# EAGLE design Timer-Ruler_CR2032_on_bottom (EAGLE 7.5.0)
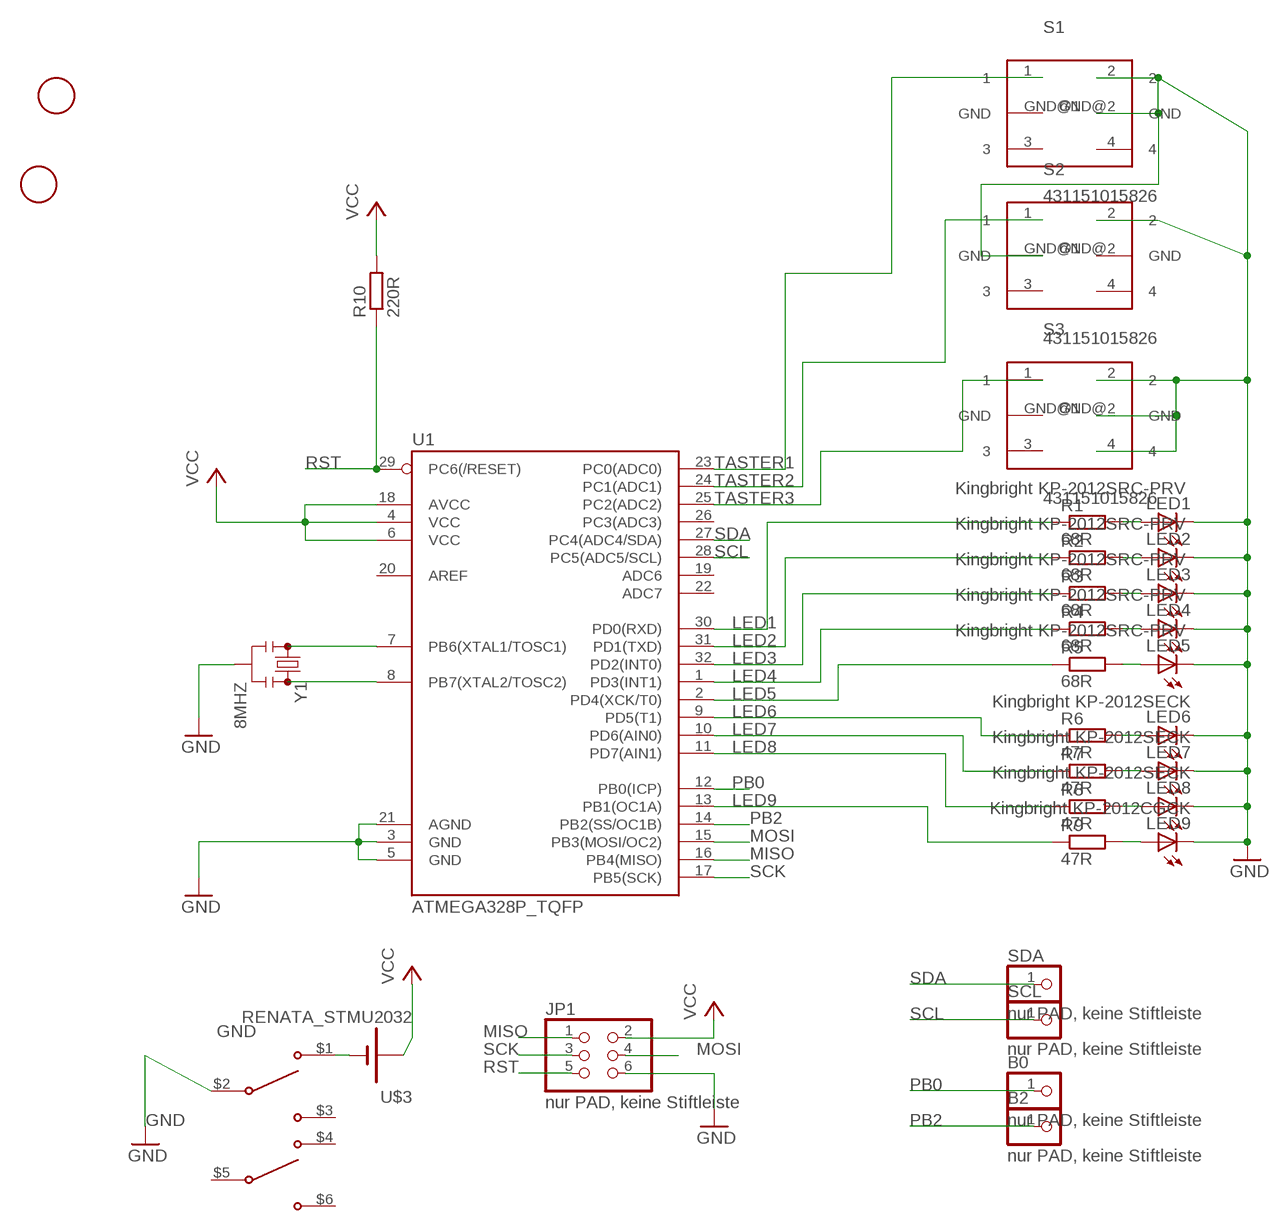
[diagram p0: schematic, sheet 1]

## Parts
B0  nur PAD, keine Stiftleiste  PINHD-1X1  [1X01]
B2  nur PAD, keine Stiftleiste  PINHD-1X1  [1X01]
JP1  nur PAD, keine Stiftleiste  PINHD-2X3  [2X03]
LED1  Kingbright KP-2012SRC-PRV  LEDCHIP-LED0805  [CHIP-LED0805]
LED2  Kingbright KP-2012SRC-PRV  LEDCHIP-LED0805  [CHIP-LED0805]
LED3  Kingbright KP-2012SRC-PRV  LEDCHIP-LED0805  [CHIP-LED0805]
LED4  Kingbright KP-2012SRC-PRV  LEDCHIP-LED0805  [CHIP-LED0805]
LED5  Kingbright KP-2012SRC-PRV  LEDCHIP-LED0805  [CHIP-LED0805]
LED6  Kingbright KP-2012SECK  LEDCHIP-LED0805  [CHIP-LED0805]
LED7  Kingbright KP-2012SECK  LEDCHIP-LED0805  [CHIP-LED0805]
LED8  Kingbright KP-2012SECK  LEDCHIP-LED0805  [CHIP-LED0805]
LED9  Kingbright KP-2012CGCK  LEDCHIP-LED0805  [CHIP-LED0805]
R1  68R  R-EU_R0402  [R0402]
R2  68R  R-EU_R0402  [R0402]
R3  68R  R-EU_R0402  [R0402]
R4  68R  R-EU_R0402  [R0402]
R5  68R  R-EU_R0402  [R0402]
R6  47R  R-EU_R0402  [R0402]
R7  47R  R-EU_R0402  [R0402]
R8  47R  R-EU_R0402  [R0402]
R9  47R  R-EU_R0402  [R0402]
R10  220R  R-EU_R0402  [R0402]
S1  431151015826  [431181015816]
S2  431151015826  [431181015816]
S3  431151015826  [431181015816]
SCL  nur PAD, keine Stiftleiste  PINHD-1X1  [1X01]
SDA  nur PAD, keine Stiftleiste  PINHD-1X1  [1X01]
U1  ATMEGA328P_TQFP  [TQFP32-08]
U$1  FIDUCIAL  [FIDUCIAL_1MM]
U$2  FIDUCIAL  [FIDUCIAL_1MM]
U$3  RENATA_STMU2032  [SMTU2032]
U$4  C+K_AYZ0202AGRLC  [C+K_AYZ0202AGRLC]
Y1  8MHZ  RESONATOR8MHZ  [RESONATOR-SMD]

## Nets
GND: JP1.6 LED1.C LED2.C LED3.C LED4.C LED5.C LED6.C LED7.C LED8.C LED9.C S1.2 S1.GND@2(GND) S2.2 S2.GND@1(GND) S3.2 S3.4 S3.GND@2(GND) U1.3(GND) U1.5(GND) U1.21(AGND) U$4.$2 Y1.2
LED1: R1.1 U1.30(PD0(RXD))
LED2: R2.1 U1.31(PD1(TXD))
LED3: R3.1 U1.32(PD2(INT0))
LED4: R4.1 U1.1(PD3(INT1))
LED5: R5.1 U1.2(PD4(XCK/T0))
LED6: R6.1 U1.9(PD5(T1))
LED7: R7.1 U1.10(PD6(AIN0))
LED8: R8.1 U1.11(PD7(AIN1))
LED9: R9.1 U1.13(PB1(OC1A))
MISO: JP1.1 U1.16(PB4(MISO))
MOSI: JP1.4 U1.15(PB3(MOSI/OC2))
N$1: LED1.A R1.2
N$2: LED2.A R2.2
N$3: LED3.A R3.2
N$4: LED4.A R4.2
N$5: LED5.A R5.2
N$6: LED6.A R6.2
N$7: LED7.A R7.2
N$8: LED8.A R8.2
N$9: LED9.A R9.2
N$10: U1.7(PB6(XTAL1/TOSC1)) Y1.1
N$12: U1.8(PB7(XTAL2/TOSC2)) Y1.3
N$14: U$3.- U$4.$1
PB0: B0.1 U1.12(PB0(ICP))
PB2: B2.1 U1.14(PB2(SS/OC1B))
RST: JP1.5 R10.1 U1.29(PC6(/RESET))
SCK: JP1.3 U1.17(PB5(SCK))
SCL: SCL.1 U1.28(PC5(ADC5/SCL))
SDA: SDA.1 U1.27(PC4(ADC4/SDA))
TASTER1: S1.1 U1.23(PC0(ADC0))
TASTER2: S2.1 U1.24(PC1(ADC1))
TASTER3: S3.1 U1.25(PC2(ADC2))
VCC: JP1.2 R10.2 U1.4(VCC) U1.6(VCC) U1.18(AVCC) U$3.+
Unconnected: S1.3 S1.4 S1.GND@1(GND) S2.3 S2.4 S2.GND@2(GND) S3.3 S3.GND@1(GND) U1.19(ADC6) U1.20(AREF) U1.22(ADC7) U1.26(PC3(ADC3)) U$4.$3 U$4.$4 U$4.$5 U$4.$6

## Library data of the parts
B0 B2 SCL SDA = pinhead:PINHD-1X1: PIN HEADER
JP1 = pinhead:PINHD-2X3: PIN HEADER
LED1-LED9 = led:LED: LED OSRAM: - CHIPLED LG R971, LG N971, LY N971, LG Q971, LY Q971, LO R971, LY R971 LH N974, LH R974 LS Q976, LO Q976, LY Q976 LO Q996 - Hyper CHIPLED LW Q18S LB Q993, LB Q99A, LB R99A - SideLED LS A670, LO A670, LY A670, LG A670, LP A670 LB A673, LV A673, LT A673, LW A673 LH A674 LY A675 LS A676, LA A676, LO A676, LY A676, LW A676 LS A679, LY A679, LG A679 - Hyper Micro SIDELED® LS Y876, LA Y876, LO Y876, LY Y876 LT Y87S - SmartLED LW L88C, LW L88S LB L89C, LB L89S, LG L890 LS L89K, LO L89K, LY L89K LS L896, LA L896, LO L896, LY L896 - TOPLED LS T670, LO T670, LY T670, LG T670, LP T670 LSG T670, LSP T670, LSY T670, LOP T670, LYG T670 LG T671, LOG T671, LSG T671 LB T673, LV T673, LT T673, LW T673 LH T674 LS T676, LA T676, LO T676, LY T676, LB T676, LH T676, LSB T676, LW T676 LB T67C, LV T67C, LT T67C, LS T67K, LO T67K, LY T67K, LW E67C LS E67B, LA E67B, LO E67B, LY E67B, LB E67C, LV E67C, LT E67C LW T67C LS T679, LY T679, LG T679 LS T770, LO T770, LY T770, LG T770, LP T770 LB T773, LV T773, LT T773, LW T773 LH T774 LS E675, LA E675, LY E675, LS T675 LS T776, LA T776, LO T776, LY T776, LB T776 LHGB T686 LT T68C, LB T68C - Hyper Mini TOPLED® LB M676 - Mini TOPLED Santana® LG M470 LS M47K, LO M47K, LY M47K Source: http://www.osram.convergy.de LUXEON: - LUMILED® LXK2-PW12-R00, LXK2-PW12-S00, LXK2-PW14-U00, LXK2-PW14-V00 LXK2-PM12-R00, LXK2-PM12-S00, LXK2-PM14-U00 LXK2-PE12-Q00, LXK2-PE12-R00, LXK2-PE12-S00, LXK2-PE14-T00, LXK2-PE14-U00 LXK2-PB12-K00, LXK2-PB12-L00, LXK2-PB12-M00, LXK2-PB14-N00, LXK2-PB14-P00, LXK2-PB14-Q00 LXK2-PR12-L00, LXK2-PR12-M00, LXK2-PR14-Q00, LXK2-PR14-R00 LXK2-PD12-Q00, LXK2-PD12-R00, LXK2-PD12-S00 LXK2-PH12-R00, LXK2-PH12-S00 LXK2-PL12-P00, LXK2-PL12-Q00, LXK2-PL12-R00 Source: www.luxeon.com KINGBRIGHT: KA-3528ASYC Source: www.kingbright.com
R1-R10 = resistor:R-EU_: RESISTOR, European symbol
S1-S3 = Wurth_Elektronik_Electromechanic_Switchs_rev15b:431151015826: WS-TSS-5x5 mm SMD Tact Switch with ground terminal, 4 pins
U1 = SparkFun-DigitalIC:ATMEGA328P_TQFP; PROD_ID: IC-09069
U$1 U$2 = adafruit:FIDUCIAL: For use by pick and place machines to calibrate the vision/machine, 1mm By microbuilder.eu
U$3 = Ava:RENATA_STMU2032
U$4 = Ava:C+K_AYZ0202AGRLC
Y1 = SparkFun-FreqCtrl:RESONATOR: Resonator Small SMD resonator. Used, eg, on the Arduino Pro/ Pro Mini boards. 8MHz- XTAL-08895 16MHz- XTAL-08900; PROD_ID: XTAL-08895

## Board
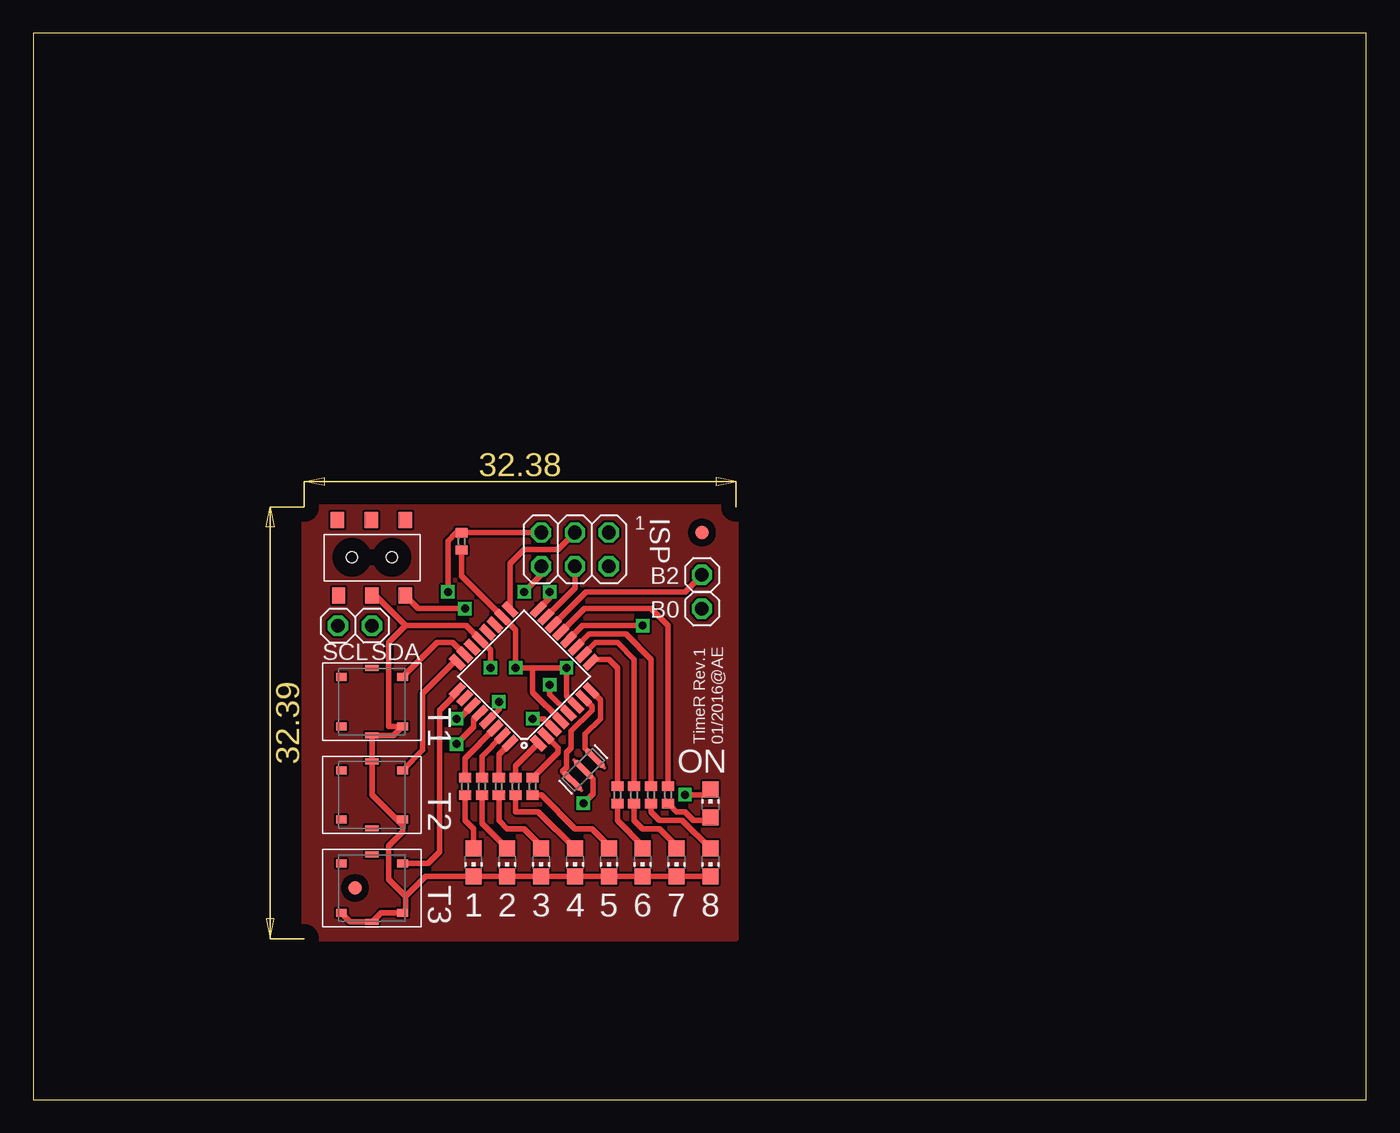
[diagram p1: board, top side]
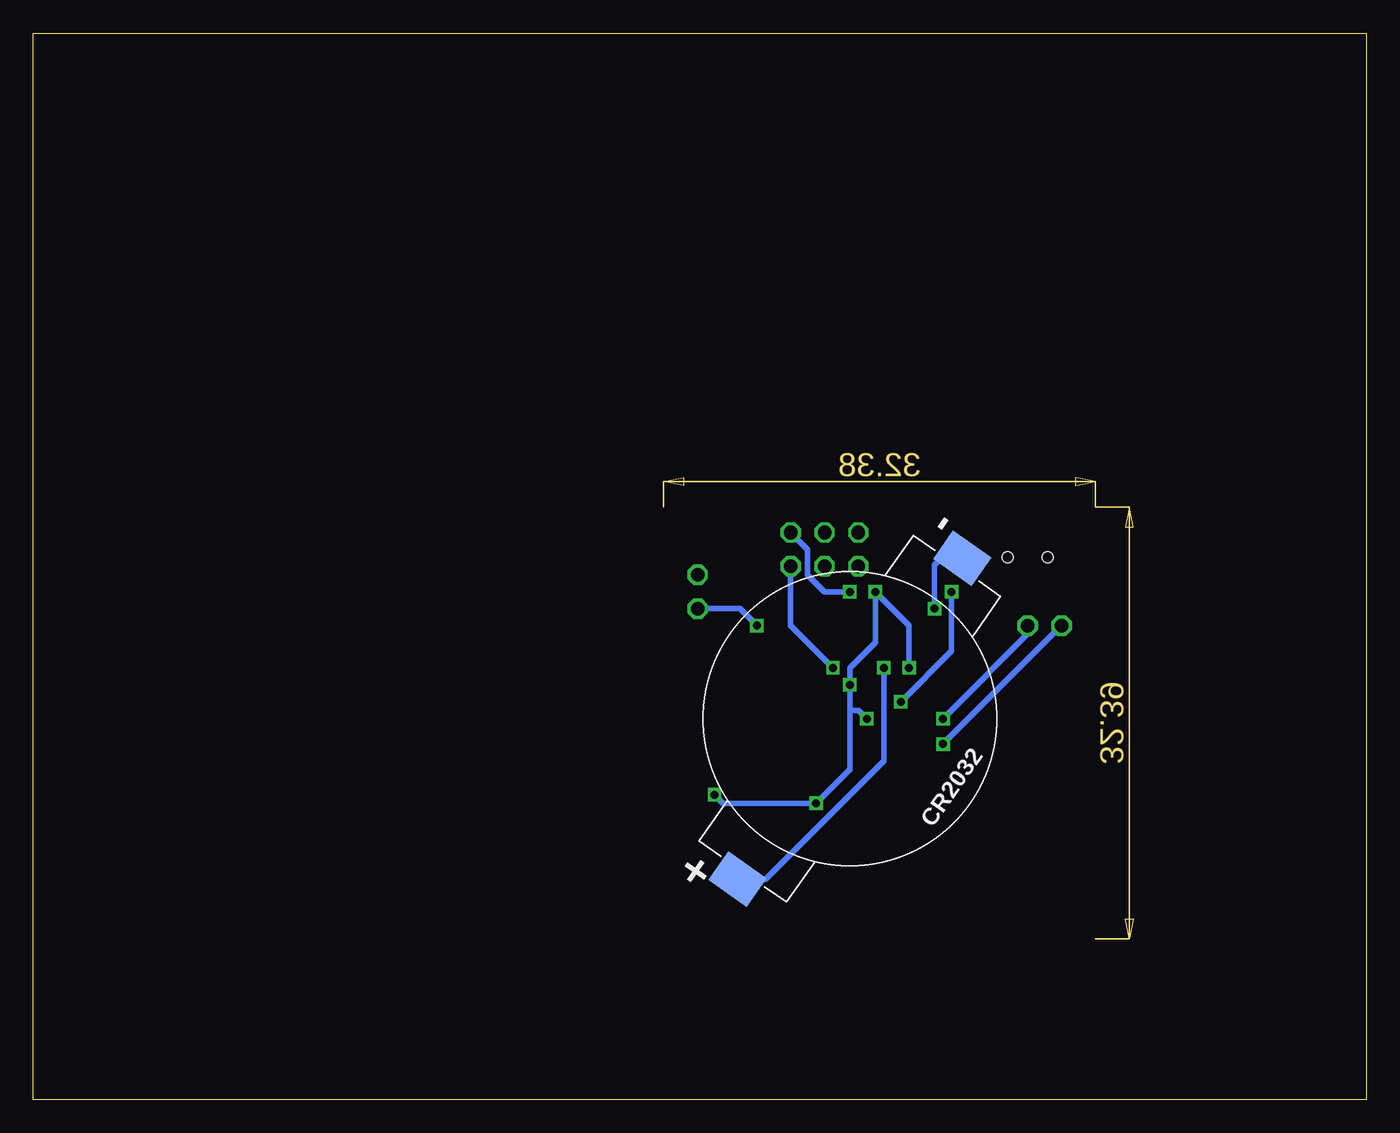
[diagram p2: board, bottom side, seen from below]

Size 100 x 80 mm. Coordinates in mm from the lower left corner, seen from the top.
Outline: 0,0 100,0 100,80 0,80 0,0
Copper layers (1*16): Top 0.035mm / dielectric 1.5mm / Bottom 0.035mm
Design rules "default *": minimum track width 0.4mm, minimum drill 0.4mm, track to track 7mil, track to pad 7mil, pad to pad 7mil, via to via 7mil, smd to smd 7mil, copper to edge 40mil, drill to drill 8mil, minimum pad ring 10mil, minimum via ring 8mil, stop-mask expansion 4mil, vias tented up to drill 0mil, thermal gap 10mil

### Footprints (pad centres in the part's own frame; a part is rotated, then mirrored left to right if it is on the bottom)
1X01 = drill 1.016 octagon: 1 0,0
2X03 = drill 1.016 octagon: 1 -2.54,-1.27; 2 -2.54,1.27; 3 0,-1.27; 4 0,1.27; 5 2.54,-1.27; 6 2.54,1.27
CHIP-LED0805 = smd 1.2 x 1.2: A 0,-1.05; C 0,1.05
R0402 = smd 0.7 x 0.9: 1 -0.65,0; 2 0.65,0
431181015816 = smd 0.8 x 0.6: 1 -2.3,-1.85; 2 -2.3,1.85; 3 2.3,-1.85; 4 2.3,1.85 | smd 1 x 0.45: GND@1 0,-2.525; GND@2 0,2.525
TQFP32-08 = smd 1.27 x 0.559: 1 -4.293,2.8; 2 -4.293,2; 3 -4.293,1.2; 4 -4.293,0.4; 5 -4.293,-0.4; 6 -4.293,-1.2; 7 -4.293,-2; 8 -4.293,-2.8; 17 4.293,-2.8; 18 4.293,-2; 19 4.293,-1.2; 20 4.293,-0.4; 21 4.293,0.4; 22 4.293,1.2; 23 4.293,2; 24 4.293,2.8 | smd 0.559 x 1.27: 9 -2.8,-4.293; 10 -2,-4.293; 11 -1.2,-4.293; 12 -0.4,-4.293; 13 0.4,-4.293; 14 1.2,-4.293; 15 2,-4.293; 16 2.8,-4.293; 25 2.8,4.293; 26 2,4.293; 27 1.2,4.293; 28 0.4,4.293; 29 -0.4,4.293; 30 -1.2,4.293; 31 -2,4.293; 32 -2.8,4.293
FIDUCIAL_1MM = smd 1 x 1: 1 0,0
SMTU2032 = smd 2.6 x 3.5: + -14.7,0; - 14.7,0
C+K_AYZ0202AGRLC = smd 1 x 1.2: $1 -2.5,2.825; $2 0,2.825; $3 2.5,2.825; $4 -2.5,-2.825; $5 0.04,-2.825; $6 2.58,-2.825 | hole 0.85: -1.5,-0.06; 1.5,-0.06
RESONATOR-SMD = smd 0.45 x 1.905: 1 -1.2,0; 2 0,0; 3 1.2,0

### Placement (x,y rotation side)
B0  50.16,36.83 0 top
B2  50.16,39.37 0 top
JP1  40.64,41.27 180 top
LED1  33.02,17.78 180 top
LED2  35.56,17.78 180 top
LED3  38.1,17.78 180 top
LED4  40.64,17.78 180 top
LED5  43.18,17.78 180 top
LED6  45.72,17.78 180 top
LED7  48.26,17.78 180 top
LED8  50.8,17.78 180 top
LED9  50.8,22.23 0 top
R1  32.38,23.5 270 top
R2  33.66,23.5 270 top
R3  34.92,23.5 270 top
R4  36.2,23.5 270 top
R5  37.47,23.5 270 top
R6  43.81,22.86 270 top
R7  45.09,22.86 270 top
R8  46.35,22.86 270 top
R9  47.62,22.86 270 top
R10  32.13,41.88 270 top
S1  25.4,29.84 180 top
S2  25.4,22.86 180 top
S3  25.4,15.88 180 top
SCL  22.86,35.56 90 top
SDA  25.4,35.56 0 top
U1  36.83,31.75 135 top
U$1  24.13,15.88 0 top
U$2  50.16,42.55 90 top
U$3  38.73,28.57 55 bottom
U$4  25.4,40.64 180 top
Y1  41.27,24.77 45 top

### Tracks (layer width: path | path; a pad name or v marks a point on that pad's centre or on a via)
GND  (via drill 0.6)
  Top 0.406: S2.2 27.7,20.56 | 27.7,20.56 25.4,22.86 S2.GND@1 S1.GND@2 27.02,27.32 S1.2 26.67,28 26.67,34.29 27.94,35.56 | LED8.C LED7.C LED6.C LED5.C LED4.C LED3.C LED2.C LED1.C 29.43,16.73 27.94,15.24 | JP1.6 38.1,39.37 v36.83,38.1 | U1.5 38.73,30.41 v38.73,31.11 | U1.3 38.31,28.57 v37.47,28.57 | v34.29,32.38 34.29,33.72 U1.21 32.45,35.56 27.94,35.56 | S3.4 23.77,13.35 S3.GND@2 26.07,14.03 S3.2 27.94,14.27 27.94,15.24 | 27.7,20.56 27.7,20.08 26.67,19.05 26.67,16.51 27.94,15.24 | 27.94,35.56 25.68,37.81 U$4.$2 | v41.27,22.23 41.99,22.94 41.99,24.05 | LED9.C 50.38,22.86 v48.9,22.86
  Bottom 0.406: v48.9,22.86 48.26,22.23 v41.27,22.23 38.73,24.77 38.73,29.21 | 38.73,29.21 v38.73,31.11 38.73,32.38 36.83,34.29 v36.83,38.1 34.29,35.56 v34.29,32.38 | v37.47,28.57 38.1,29.21 38.73,29.21
LED1
  Top 0.406: R1.1 32.38,25.61 U1.30
LED2
  Top 0.406: R2.1 33.66,25.75 U1.31
LED3
  Top 0.406: R3.1 34.92,25.89 U1.32
LED4
  Top 0.406: U1.1 36.2,25.04 R4.1
LED5
  Top 0.406: U1.2 39.37,26.38 39.37,26.04 R5.1
LED6
  Top 0.406: U1.9 42.06,33.02 43.18,33.02 43.81,32.38 R6.1
LED7
  Top 0.406: U1.10 42.2,34.29 43.81,34.29 45.09,33.02 R7.1
LED8
  Top 0.406: U1.11 41.7,34.92 44.45,34.92 46.35,33.02 R8.1
LED9
  Top 0.406: U1.13 41.34,36.83 46.35,36.83 47.62,35.56 R9.1
MISO  (via drill 0.6)
  Top 0.406: v38.73,38.1 38.73,37.62 U1.16
  Bottom 0.406: JP1.1 41.91,41.27 41.91,39.37 40.64,38.1 v38.73,38.1
MOSI
  Top 0.406: JP1.4 40.64,38.39 U1.15
N$1
  Top 0.406: R1.2 32.38,20.95 33.02,20.32 LED1.A
N$2
  Top 0.406: R2.2 33.66,20.73 LED2.A
N$3
  Top 0.406: R3.2 34.92,20.95 35.56,20.32 36.83,20.32 38.1,19.05 LED3.A
N$4
  Top 0.406: R4.2 36.2,21.59 37.88,21.59 LED4.A
N$5
  Top 0.406: R5.2 38.12,22.84 40.64,20.32 41.91,20.32 43.18,19.05 LED5.A
N$6
  Top 0.406: R6.2 43.81,20.95 45.72,19.05 LED6.A
N$7
  Top 0.406: R7.2 45.09,20.95 45.72,20.32 46.99,20.32 48.26,19.05 LED7.A
N$8
  Top 0.406: R8.2 46.35,21.59 46.99,20.95 48.67,20.95 LED8.A
N$9
  Top 0.406: R9.2 47.64,22.21 48.26,21.59 48.9,21.59 49.53,20.95 50.58,20.95 LED9.A
N$10
  Top 0.406: U1.7 41.91,29.5 41.91,29.21 40.34,27.64 40.34,26.37 40.01,26.04 40.01,24.93 39.71,24.64
N$11
  pour Top: 20.32,44.45 52.7,44.45 52.7,12.06 20.32,12.06
N$12
  Top 0.406: U1.8 42.55,30 42.55,28.57 41.41,27.43 41.41,26.33
N$14  (via drill 0.6)
  Top 0.406: v32.38,36.83 28.89,36.83 U$4.$1
  Bottom 0.406: v32.38,36.83 32.38,40.1 31.87,40.62 U$3.-
PB0  (via drill 0.6)
  Top 0.406: U1.12 41.21,35.56 v45.72,35.56
  Bottom 0.406: v45.72,35.56 46.99,36.83 B0.1
PB2
  Top 0.406: U1.14 41.48,38.1 48.9,38.1 B2.1
RST  (via drill 0.6)
  Top 0.406: U1.29 34.92,29.28 v34.92,29.84 | v31.11,38.1 31.11,41.91 31.73,42.53 R10.1 32.15,42.55 JP1.5
  Bottom 0.406: v34.92,29.84 31.11,33.66 v31.11,38.1
SCK
  Top 0.406: JP1.3 39.37,41.27 36.83,41.27 35.77,40.22 U1.17
SCL  (via drill 0.6)
  Top 0.406: U1.28 33.02,28.51 33.02,27.94 v31.75,26.67
  Bottom 0.406: v31.75,26.67 SCL.1
SDA  (via drill 0.6)
  Top 0.406: U1.27 31.96,28.57 v31.75,28.57
  Bottom 0.406: v31.75,28.57 24.77,35.56 SDA.1
TASTER1
  Top 0.406: U1.23 31.46,34.29 30.3,34.29 S1.1
TASTER2
  Top 0.406: S2.1 29.21,26.22 29.21,30.48 31.54,32.8 U1.24
TASTER3
  Top 0.406: U1.25 31.82,30.55 30.48,29.21 30.48,18.6 29.61,17.73 S3.1
VCC  (via drill 0.6)
  Top 0.406: R10.2 32.13,39.27 U1.18 36.2,35.21 v36.2,32.38 37.47,32.38 | U1.4 37.47,30.55 37.47,32.38 | 37.47,32.38 v40.01,32.38 40.01,30.27 U1.6
  Bottom 0.406: JP1.2 43.18,35.56 v40.01,32.38 | v36.2,32.38 36.2,25.4 45.06,16.53 U$3.+

### Text on the board
tNames: 1 | ISP | T1 | TimeR Rev.1 / 01/2016@AE | ON | T2 | T3 | 1 | 2 | 3 | 4 | 5 | 6 | 7 | 8